# EAGLE design IPNS_v0.1 STIM (EAGLE 8.0.0)
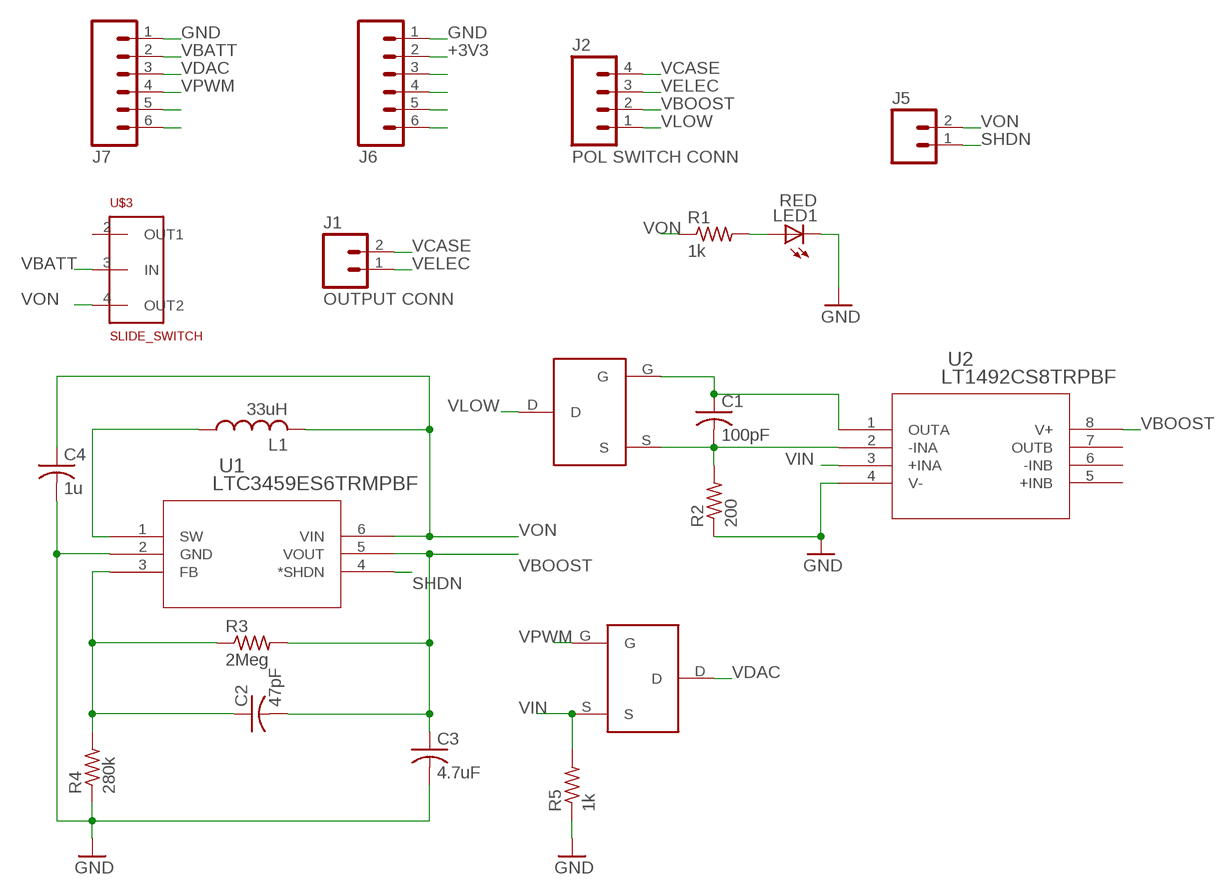
[diagram p0: schematic, sheet 1]

## Parts
C1  100pF  C-USC0805  [C0805]
C2  47pF  C-USC0805  [C0805]
C3  4.7uF  C-USC0805  [C0805]
C4  1u  C-USC0805  [C0805]
J1  OUTPUT CONN  M02PTH  [1X02]
J2  POL SWITCH CONN  M04PTH  [1X04]
J5  M02PTH  [1X02]
J6  M06SILK_FEMALE_PTH  [1X06]
J7  M06SILK_FEMALE_PTH  [1X06]
L1  33uH  L-USL2012C  [L2012C]
LED1  RED  LEDCHIP-LED0805  [CHIP-LED0805]
R1  1k  R-US_M0805  [M0805]
R2  200  R-US_R0805  [R0805]
R3  2Meg  R-US_R0805  [R0805]
R4  280k  R-US_R0805  [R0805]
R5  1k  R-US_R0805  [R0805]
U1  LTC3459ES6TRMPBF  [TSOT-23_S6]
U2  LT1492CS8TRPBF  [SO-8_S]
U$1  DMN1019USN  [DMN1019USN]
U$2  DMN1019USN  [DMN1019USN]
U$3  SLIDE_SWITCH  [SLIDE_SWITCH]

## Nets
+3V3: J6.2
GND: C3.2 C4.2 J6.1 J7.1 LED1.C R2.1 R4.1 R5.1 U1.2(GND) U2.4(V-)
N$1: LED1.A R1.2
N$2: C1.1 U2.1(OUTA) U$1.G
N$3: J6.6
N$4: C1.2 R2.2 U2.2(-INA) U$1.S
N$5: C2.1 R3.1 R4.2 U1.3(FB)
N$6: L1.1 U1.1(SW)
N$25: J6.5
N$26: J6.4
N$27: J6.3
N$29: J7.5
N$30: J7.6
SHDN: J5.1 U1.4(*SHDN)
VBATT: J7.2 U$3.3(IN)
VBOOST: C2.2 C3.1 J2.2 R3.2 U1.5(VOUT) U2.8(V+)
VCASE: J1.2 J2.4
VDAC: J7.3 U$2.D
VELEC: J1.1 J2.3
VIN: R5.2 U2.3(+INA) U$2.S
VLOW: J2.1 U$1.D
VON: C4.1 J5.2 L1.2 R1.1 U1.6(VIN) U$3.4(OUT2)
VPWM: J7.4 U$2.G
Unconnected: U2.5(+INB) U2.6(-INB) U2.7(OUTB) U$3.2(OUT1)

## Library data of the parts
C1-C4 = IPNS_Lib_v0.1:C-US: CAPACITOR, American symbol
J1 J5 = IPNS_Lib_v0.1:M02: Standard 2-pin 0.1" header. Use with - straight break away headers ( PRT-00116) - right angle break away headers (PRT-00553) - swiss pins (PRT-00743) - machine pins (PRT-00117) - female headers (PRT-00115) Molex polarized connector foot print use with: PRT-08233 with associated crimp pins and housings. 2.54_SCREWTERM for use with PRT-10571. 3.5mm Screw Terminal footprints for PRT-08084 5mm Screw Terminal footprints for use with PRT-08432
J2 = IPNS_Lib_v0.1:M04: Header 4 Standard 4-pin 0.1" header. Use with straight break away headers (SKU : PRT-00116), right angle break away headers (PRT-00553), swiss pins (PRT-00743), machine pins (PRT-00117), and female headers (PRT-00115). Molex polarized connector foot print use with SKU : PRT-08231 with associated crimp pins and housings. 1MM SMD Version SKU: PRT-10208; PROD_ID: CONN-09696
J6 J7 = IPNS_Lib_v0.1:M06: Header 6 Standard 6-pin 0.1" header. Use with straight break away headers (SKU : PRT-00116), right angle break away headers (PRT-00553), swiss pins (PRT-00743), machine pins (PRT-00117), and female headers (PRT-00115). Molex polarized connector foot print use with SKU : PRT-08094 with associated crimp pins and housings. NOTES ON THE VARIANTS LOCK and LOCK_LONGPADS... This footprint was designed to help hold the alignment of a through-hole component (i.e. 6-pin header) while soldering it into place. You may notice that each hole has been shifted either up or down by 0.005 of an inch from it's more standard position (which is a perfectly straight line). This slight alteration caused the pins (the squares in the middle) to touch the edges of the holes. Because they are alternating, it causes a "brace" to hold the component in place. 0.005 has proven to be the perfect amount of "off-center" position when using our standard breakaway headers. Although looks a little odd when you look at the bare footprint, once you have a header in there, the alteration is very hard to notice. Also,if you push a header all the way into place, it is covered up entirely on the bottom side. This idea of altering the position of holes to aid alignment will be further integrated into the Sparkfun Library for other footprints. It can help hold any component with 3 or more connection pins.; PROD_ID: CONN-08437
L1 = IPNS_Lib_v0.1:L-US: INDUCTOR, American symbol
LED1 = IPNS_Lib_v0.1:LED: LED OSRAM: - CHIPLED LG R971, LG N971, LY N971, LG Q971, LY Q971, LO R971, LY R971 LH N974, LH R974 LS Q976, LO Q976, LY Q976 LO Q996 - Hyper CHIPLED LW Q18S LB Q993, LB Q99A, LB R99A - SideLED LS A670, LO A670, LY A670, LG A670, LP A670 LB A673, LV A673, LT A673, LW A673 LH A674 LY A675 LS A676, LA A676, LO A676, LY A676, LW A676 LS A679, LY A679, LG A679 - Hyper Micro SIDELED® LS Y876, LA Y876, LO Y876, LY Y876 LT Y87S - SmartLED LW L88C, LW L88S LB L89C, LB L89S, LG L890 LS L89K, LO L89K, LY L89K LS L896, LA L896, LO L896, LY L896 - TOPLED LS T670, LO T670, LY T670, LG T670, LP T670 LSG T670, LSP T670, LSY T670, LOP T670, LYG T670 LG T671, LOG T671, LSG T671 LB T673, LV T673, LT T673, LW T673 LH T674 LS T676, LA T676, LO T676, LY T676, LB T676, LH T676, LSB T676, LW T676 LB T67C, LV T67C, LT T67C, LS T67K, LO T67K, LY T67K, LW E67C LS E67B, LA E67B, LO E67B, LY E67B, LB E67C, LV E67C, LT E67C LW T67C LS T679, LY T679, LG T679 LS T770, LO T770, LY T770, LG T770, LP T770 LB T773, LV T773, LT T773, LW T773 LH T774 LS E675, LA E675, LY E675, LS T675 LS T776, LA T776, LO T776, LY T776, LB T776 LHGB T686 LT T68C, LB T68C - Hyper Mini TOPLED® LB M676 - Mini TOPLED Santana® LG M470 LS M47K, LO M47K, LY M47K Source: http://www.osram.convergy.de LUXEON: - LUMILED® LXK2-PW12-R00, LXK2-PW12-S00, LXK2-PW14-U00, LXK2-PW14-V00 LXK2-PM12-R00, LXK2-PM12-S00, LXK2-PM14-U00 LXK2-PE12-Q00, LXK2-PE12-R00, LXK2-PE12-S00, LXK2-PE14-T00, LXK2-PE14-U00 LXK2-PB12-K00, LXK2-PB12-L00, LXK2-PB12-M00, LXK2-PB14-N00, LXK2-PB14-P00, LXK2-PB14-Q00 LXK2-PR12-L00, LXK2-PR12-M00, LXK2-PR14-Q00, LXK2-PR14-R00 LXK2-PD12-Q00, LXK2-PD12-R00, LXK2-PD12-S00 LXK2-PH12-R00, LXK2-PH12-S00 LXK2-PL12-P00, LXK2-PL12-Q00, LXK2-PL12-R00 Source: www.luxeon.com KINGBRIGHT: KA-3528ASYC Source: www.kingbright.com
R1-R5 = IPNS_Lib_v0.1:R-US_: RESISTOR, American symbol
U1 = IPNS_Lib_v0.1:LTC3459ES6TRMPBF; COPYRIGHT: Copyright (C) 2016 Accelerated Designs. All rights reserved; MANUFACTURER_PART_NUMBER: ltc3459es6#trmpbf; VENDOR: Linear Technology
U2 = IPNS_Lib_v0.1:LT1492CS8TRPBF; MANUFACTURER_PART_NUMBER: lt1492cs8#trpbf; VENDOR: Linear Technology
U$1 U$2 = IPNS_Lib_v0.1:DMN1019USN
U$3 = IPNS_Lib_v0.1:SLIDE_SWITCH

## Net classes
0 default: width 0.254 mm, drill 0.254 mm, clearance 0.152 mm

## Board
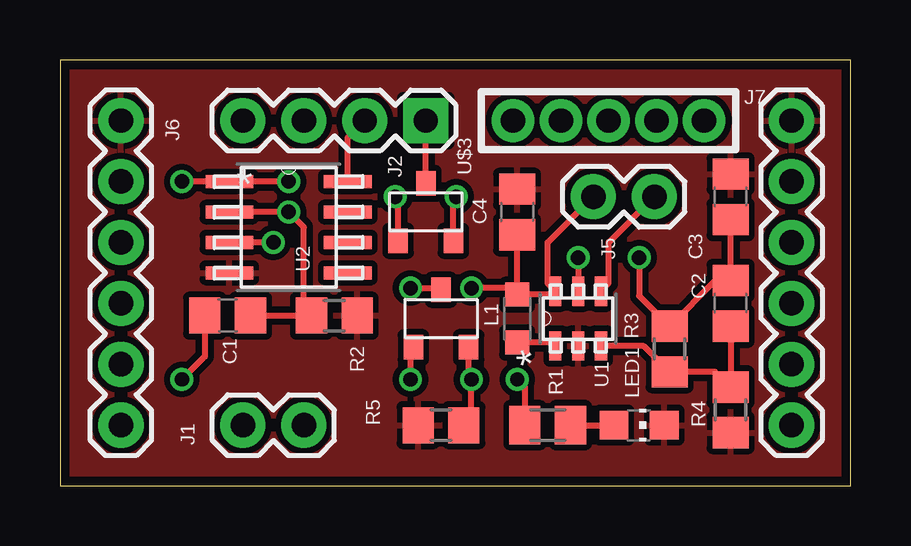
[diagram p1: board, top side]
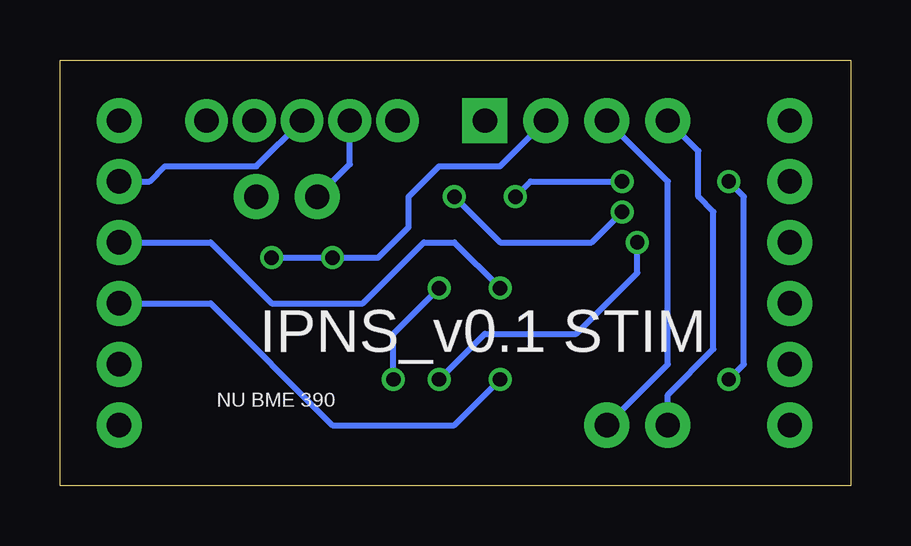
[diagram p2: board, bottom side, seen from below]

Size 32.94 x 17.77 mm. Coordinates in mm from the lower left corner, seen from the top.
Outline: 0,0 32.94,0 32.94,17.77 0,17.77 0,0
Copper layers (1*16): Top 0.0356mm / dielectric 1.5011mm / Bottom 0.0356mm
Design rules "Dorkbotpdx": minimum track width 6mil, minimum drill 13mil, track to track 6mil, track to pad 6mil, pad to pad 6mil, via to via 6mil, smd to smd 6mil, copper to edge 15mil, drill to drill 6mil, minimum pad ring 7mil, minimum via ring 7mil, stop-mask expansion 4mil, vias tented up to drill 0mil, thermal gap 10mil

### Footprints (pad centres in the part's own frame; a part is rotated, then mirrored left to right if it is on the bottom)
C0805 = smd 1.3 x 1.5: 1 -0.95,0; 2 0.95,0
1X02 = drill 1.016 pad 1.88: 1 0,0; 2 2.54,0
1X04 = drill 1.016 pad 1.88 square: 1 0,0 | drill 1.016 pad 1.88: 2 2.54,0; 3 5.08,0; 4 7.62,0
1X06 = drill 1.016 pad 1.88: 1 0,0; 2 2.54,0; 3 5.08,0; 4 7.62,0; 5 10.16,0; 6 12.7,0
L2012C = smd 1 x 1: 1 -1,0; 2 1,0
CHIP-LED0805 = smd 1.2 x 1.2: A 0,-1.05; C 0,1.05
M0805 = smd 1.3 x 1.6: 1 -0.95,0; 2 0.95,0
R0805 = smd 1.3 x 1.5: 1 -0.95,0; 2 0.95,0
TSOT-23_S6 = smd 1.219 x 0.508: 1 -1.143,0.95; 2 -1.143,0; 3 -1.143,-0.95; 4 1.143,-0.95; 5 1.143,0; 6 1.143,0.95
SO-8_S = smd 1.981 x 0.533: 1 -2.464,1.905; 2 -2.464,0.635; 3 -2.464,-0.635; 4 -2.464,-1.905; 5 2.464,-1.905; 6 2.464,-0.635; 7 2.464,0.635; 8 2.464,1.905
DMN1019USN = smd 1.016 x 0.813: D 1.2,0; G -1.2,1.15; S -1.2,-1.15
SLIDE_SWITCH = drill 1.016 pad 1.778: 1 -3.98,0; 2 -1.99,0; 3 0,0; 4 1.99,0; 5 3.98,0

### Placement (x,y rotation side)
C1  6.99,7.11 0 top
C2  27.94,7.62 90 top
C3  27.94,12.06 90 top
C4  19.05,11.43 90 top
J1  10.16,2.54 180 top
J2  15.24,15.24 180 top
J5  24.77,12.06 180 top
J6  2.54,15.24 270 top
J7  30.48,15.24 270 top
L1  19.05,6.99 90 top
LED1  24.13,2.54 270 top
R1  20.32,2.54 0 top
R2  11.43,7.11 180 top
R3  25.4,5.71 90 top
R4  27.94,3.17 90 top
R5  15.88,2.54 0 top
U1  21.59,6.99 90 top
U2  9.53,10.79 0 top
U$1  15.24,11.43 90 top
U$2  15.88,6.99 90 top
U$3  22.86,15.24 180 top

### Tracks (layer width: path | path; a pad name or v marks a point on that pad's centre or on a via)
GND
  pour Top (isolate 0.254): 0,17.78 0,0 33.02,0 33.02,17.78
N$1
  Top 0.254: R1.2 LED1.A
N$2  (via drill 0.6)
  Top 0.254: v9.53,12.7 U2.1 | U$1.G 14.09,11.95 v13.97,12.06 | 6.35,12.7 U2.1 | C1.1 6.04,5.4 v5.08,4.45 | U2.1 v5.08,12.7
  Bottom 0.254: v13.97,12.06 13.34,12.7 v9.53,12.7 | v5.08,4.45 4.45,5.08 4.45,12.06 v5.08,12.7
N$4  (via drill 0.6)
  Top 0.254: U2.2 v9.53,11.43 10.16,10.79 10.16,6.67 R2.2 C1.2 | U$1.S 16.39,11.95 v16.51,12.06
  Bottom 0.254: v16.51,12.06 14.61,10.16 10.79,10.16 v9.53,11.43
N$5
  Top 0.254: C2.1 R4.2 27.3,4.76 R3.1 24.32,5.84 U1.3
N$6
  Top 0.254: U1.1 20.5,5.99 L1.1
SHDN
  Top 0.254: U1.4 22.86,8.45 22.86,10.16 J5.1
VBATT
  Bottom 0.254: J7.2 29.21,12.7 28.57,13.34 24.77,13.34 U$3.3
VBOOST  (via drill 0.6)
  Top 0.254: v21.59,9.53 U1.5 | U2.8 11.99,14.53 J2.2 | v24.13,9.53 24.13,7.93 R3.2 27.3,8.57 C2.2 C3.1
  Bottom 0.254: v24.13,9.53 v21.59,9.53 19.68,9.53 18.41,10.79 18.41,12.06 17.14,13.34 14.61,13.34 J2.2
VCASE
  Bottom 0.254: J1.2 7.62,3.81 5.71,5.71 5.71,11.43 6.35,12.06 6.35,13.97 J2.4
VDAC  (via drill 0.6)
  Top 0.254: v14.61,8.26 15.8,8.26 U$2.D
  Bottom 0.254: v14.61,8.26 16.51,10.16 17.78,10.16 20.32,7.62 24.13,7.62 26.67,10.16 J7.3
VELEC
  Bottom 0.254: J1.1 7.62,5.08 7.62,12.7 J2.3
VIN  (via drill 0.6)
  Top 0.254: R5.2 17.14,2.86 v17.14,4.45 17.02,4.57 U$2.S | v8.89,10.16 U2.3
  Bottom 0.254: v17.14,4.45 15.24,6.35 11.43,6.35 8.89,8.89 v8.89,10.16
VLOW
  Top 0.254: U$1.D J2.1
VON  (via drill 0.6)
  Top 0.254: L1.2 20.5,7.99 U1.6 20.32,8.45 20.32,10.16 J5.2 | L1.2 18.78,8.26 v17.14,8.26 | v19.05,4.45 19.37,4.12 R1.1 | L1.2 C4.1
  Bottom 0.254: v19.05,4.45 19.05,6.35 v17.14,8.26 | J5.2 20.87,13.42 U$3.4
VPWM  (via drill 0.6)
  Top 0.254: v14.61,4.45 14.61,5.67 U$2.G
  Bottom 0.254: v14.61,4.45 16.51,2.54 21.59,2.54 26.67,7.62 J7.4

### Text on the board
bPlace: IPNS_v0.1 STIM | NU BME 390